# Altium schematic sheet Sheet1.SchDoc
size A; SheetNumber: 1; SheetTotal: 1
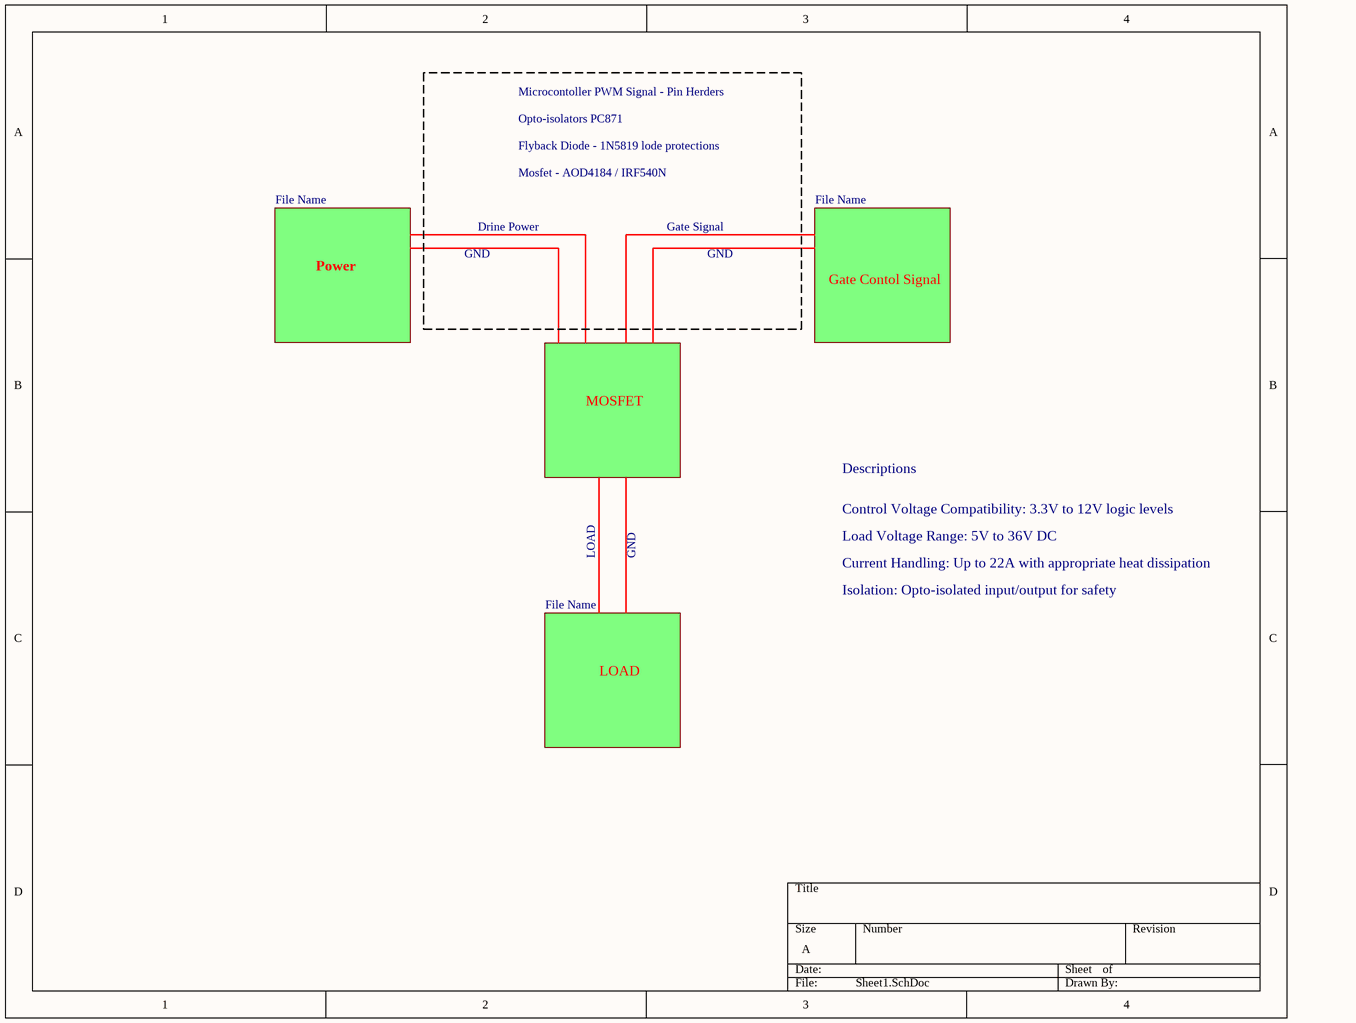
[diagram p0: Sheet1.SchDoc]

## Sub-sheets
Designator = File Name: no entries
Designator = File Name: no entries
Designator = File Name: no entries
Designator = File Name: no entries

## Notes on the sheet
- Microcontoller PWM Signal - Pin Herders
- Opto-isolators PC871
- Flyback Diode - 1N5819 lode protections
- Drine Power
- Mosfet - AOD4184 / IRF540N
- Gate Signal
- Power
- GND
- Gate Contol Signal
- MOSFET
- Descriptions
- LOAD
- Control Voltage Compatibility: 3.3V to 12V logic levels
- Load Voltage Range: 5V to 36V DC
- Current Handling: Up to 22A with appropriate heat dissipation
- Isolation: Opto-isolated input/output for safety